# Altium schematic sheet EE25_transformer.schdoc
size 57 x 48 mm
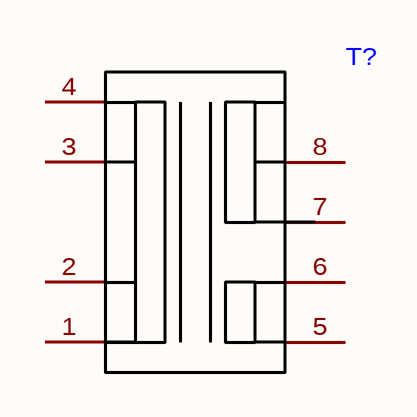
[diagram p0: EE25_transformer.schdoc]

## Parts
T?  (no value)  [EE25]

## Nets

Not connected (* = marked no-connect by the designer): T? 1 2 3 4 5 6 7 8

## Library data of the parts
T? = EE25